# EAGLE design INA219x4 FeatherWing (EAGLE 9.4.2)
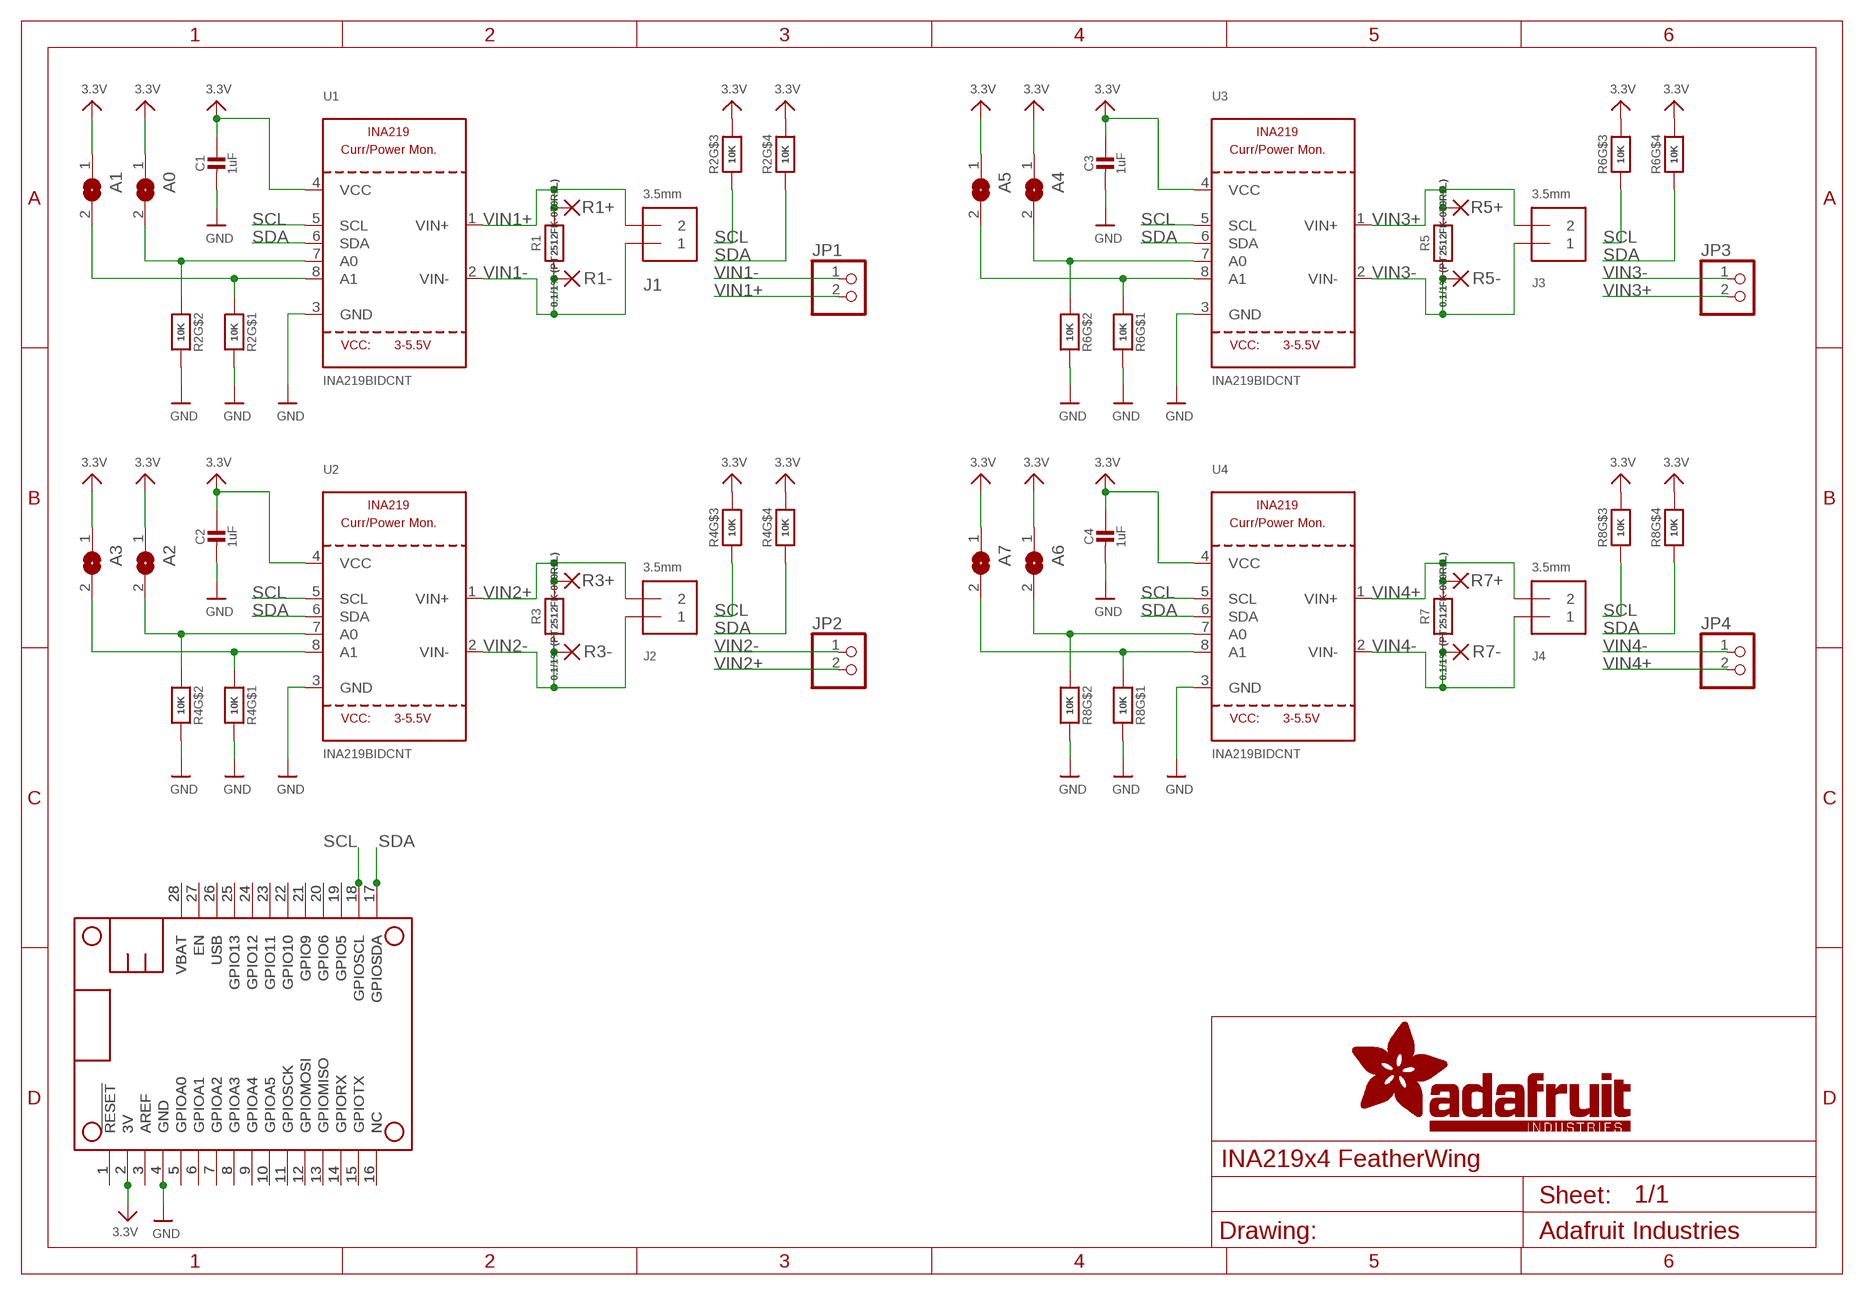
[diagram p0: schematic, sheet 1]

## Parts
A0  SOLDERJUMPERREFLOW_NOPASTE  [SOLDERJUMPER_REFLOW_NOPASTE]
A1  SOLDERJUMPERREFLOW_NOPASTE  [SOLDERJUMPER_REFLOW_NOPASTE]
A2  SOLDERJUMPERREFLOW_NOPASTE  [SOLDERJUMPER_REFLOW_NOPASTE]
A3  SOLDERJUMPERREFLOW_NOPASTE  [SOLDERJUMPER_REFLOW_NOPASTE]
A4  SOLDERJUMPERREFLOW_NOPASTE  [SOLDERJUMPER_REFLOW_NOPASTE]
A5  SOLDERJUMPERREFLOW_NOPASTE  [SOLDERJUMPER_REFLOW_NOPASTE]
A6  SOLDERJUMPERREFLOW_NOPASTE  [SOLDERJUMPER_REFLOW_NOPASTE]
A7  SOLDERJUMPERREFLOW_NOPASTE  [SOLDERJUMPER_REFLOW_NOPASTE]
C1  1uF  CAP_CERAMIC0805-NOOUTLINE  [0805-NO@1]
C2  1uF  CAP_CERAMIC0805-NOOUTLINE  [0805-NO@1]
C3  1uF  CAP_CERAMIC0805-NOOUTLINE  [0805-NO@1]
C4  1uF  CAP_CERAMIC0805-NOOUTLINE  [0805-NO@1]
J1  3.5mm  TERMBLOCK_1X2  [TERMBLOCK_1X2-3.5MM]
J2  3.5mm  TERMBLOCK_1X2  [TERMBLOCK_1X2-3.5MM]
J3  3.5mm  TERMBLOCK_1X2  [TERMBLOCK_1X2-3.5MM]
J4  3.5mm  TERMBLOCK_1X2  [TERMBLOCK_1X2-3.5MM]
JP1  HEADER-1X2ROUND  [1X02_ROUND]
JP2  HEADER-1X2ROUND  [1X02_ROUND]
JP3  HEADER-1X2ROUND  [1X02_ROUND]
JP4  HEADER-1X2ROUND  [1X02_ROUND]
MS1  FEATHERWING_NODIM  [FEATHERWING_DIM]
MS2  FEATHERWING_NODIM  [FEATHERWING_DIM]
R1  0.1/1% (PT2512FK-070R1L)  RESISTOR2512  [2512]
R1+  1,6/0,9  [1,6/0,9]
R1-  1,6/0,9  [1,6/0,9]
R2  10K  RESISTOR_4PACK  [RESPACK_4X0603]
R3  0.1/1% (PT2512FK-070R1L)  RESISTOR2512  [2512]
R3+  1,6/0,9  [1,6/0,9]
R3-  1,6/0,9  [1,6/0,9]
R4  10K  RESISTOR_4PACK  [RESPACK_4X0603]
R5  0.1/1% (PT2512FK-070R1L)  RESISTOR2512  [2512]
R5+  1,6/0,9  [1,6/0,9]
R5-  1,6/0,9  [1,6/0,9]
R6  10K  RESISTOR_4PACK  [RESPACK_4X0603]
R7  0.1/1% (PT2512FK-070R1L)  RESISTOR2512  [2512]
R7+  1,6/0,9  [1,6/0,9]
R7-  1,6/0,9  [1,6/0,9]
R8  10K  RESISTOR_4PACK  [RESPACK_4X0603]
U1  INA219BIDCNT  INA219  [SOT23-8]
U2  INA219BIDCNT  INA219  [SOT23-8]
U3  INA219BIDCNT  INA219  [SOT23-8]
U4  INA219BIDCNT  INA219  [SOT23-8]

## Nets
3.3V: A0.1 A1.1 A2.1 A3.1 A4.1 A5.1 A6.1 A7.1 C1.1 C2.1 C3.1 C4.1 MS1.2(3V) MS2.2(3V) R2.5 R2.6 R4.5 R4.6 R6.5 R6.6 R8.5 R8.6 U1.4(VCC) U2.4(VCC) U3.4(VCC) U4.4(VCC)
GND: C1.2 C2.2 C3.2 C4.2 MS1.4(GND) MS2.4(GND) R2.7 R2.8 R4.7 R4.8 R6.7 R6.8 R8.7 R8.8 U1.3(GND) U2.3(GND) U3.3(GND) U4.3(GND)
N$1: MS1.27(EN) MS2.27(EN)
N$2: MS1.16(NC) MS2.16(NC)
N$3: MS1.25(GPIO13) MS2.25(GPIO13)
N$4: MS1.15(GPIOTX) MS2.15(GPIOTX)
N$5: MS1.24(GPIO12) MS2.24(GPIO12)
N$6: MS1.14(GPIORX) MS2.14(GPIORX)
N$7: MS1.13(GPIOMISO) MS2.13(GPIOMISO)
N$8: MS1.12(GPIOMOSI) MS2.12(GPIOMOSI)
N$9: MS1.11(GPIOSCK) MS2.11(GPIOSCK)
N$10: MS1.10(GPIOA5) MS2.10(GPIOA5)
N$11: MS1.9(GPIOA4) MS2.9(GPIOA4)
N$12: MS1.8(GPIOA3) MS2.8(GPIOA3)
N$13: MS1.7(GPIOA2) MS2.7(GPIOA2)
N$14: MS1.6(GPIOA1) MS2.6(GPIOA1)
N$15: MS1.5(GPIOA0) MS2.5(GPIOA0)
N$16: A1.2 R2.1 U1.8(A1)
N$17: MS1.3(AREF) MS2.3(AREF)
N$18: MS1.1(!RESET) MS2.1(!RESET)
N$19: MS1.23(GPIO11) MS2.23(GPIO11)
N$20: MS1.22(GPIO10) MS2.22(GPIO10)
N$21: MS1.21(GPIO9) MS2.21(GPIO9)
N$22: MS1.20(GPIO6) MS2.20(GPIO6)
N$23: MS1.19(GPIO5) MS2.19(GPIO5)
N$24: A5.2 R6.1 U3.8(A1)
N$25: A4.2 R6.2 U3.7(A0)
N$26: A0.2 R2.2 U1.7(A0)
N$27: A3.2 R4.1 U2.8(A1)
N$28: A2.2 R4.2 U2.7(A0)
N$29: A7.2 R8.1 U4.8(A1)
N$30: A6.2 R8.2 U4.7(A0)
SCL: MS1.18(GPIOSCL) MS2.18(GPIOSCL) R2.3 R4.3 R6.3 R8.3 U1.5(SCL) U2.5(SCL) U3.5(SCL) U4.5(SCL)
SDA: MS1.17(GPIOSDA) MS2.17(GPIOSDA) R2.4 R4.4 R6.4 R8.4 U1.6(SDA) U2.6(SDA) U3.6(SDA) U4.6(SDA)
USB: MS1.26(USB) MS2.26(USB)
VBAT: MS1.28(VBAT) MS2.28(VBAT)
VIN1+: J1.2 JP1.2 R1+.1(P) R1.2 U1.1(VIN+)
VIN1-: J1.1 JP1.1 R1-.1(P) R1.1 U1.2(VIN-)
VIN2+: J2.2 JP2.2 R3+.1(P) R3.2 U2.1(VIN+)
VIN2-: J2.1 JP2.1 R3-.1(P) R3.1 U2.2(VIN-)
VIN3+: J3.2 JP3.2 R5+.1(P) R5.2 U3.1(VIN+)
VIN3-: J3.1 JP3.1 R5-.1(P) R5.1 U3.2(VIN-)
VIN4+: J4.2 JP4.2 R7+.1(P) R7.2 U4.1(VIN+)
VIN4-: J4.1 JP4.1 R7-.1(P) R7.1 U4.2(VIN-)

## Library data of the parts
A0 A1-A7 = microbuilder:SOLDERJUMPER: SMD Solder JUMPER Solder the two pads together to create a connection, or remove the solder to break it. REFLOW - Use this footprint for solder paste and reflow ovens. WAVE - Use this footprint for hand-soldering (larger pads). CLOSED - Has a trace between the two pads to ensure it is closed by default. The trace needs to be cut to disable the jumper, and can be closed again by creating a solder bridge between the two pads.
C1-C4 = microbuilder:CAP_CERAMIC: Ceramic Capacitors For new designs, use the packages preceded by an '_' character since they are more reliable: The following footprints should be used on most boards: _0402 - Standard footprint for regular board layouts _0603 - Standard footprint for regular board layouts _0805 - Standard footprint for regular board layouts _1206 - Standard footprint for regular board layouts For extremely tight-pitch boards where space is at a premium, the following 'micro-pitch' footprints can be used (smaller pads, no silkscreen outline, etc.): _0402MP - Micro-pitch footprint for very dense/compact boards _0603MP - Micro-pitch footprint for very dense/compact boards _0805MP - Micro-pitch footprint for very dense/compact boards _1206MP - Micro-pitch footprint for very dense/compact boards
J1-J4 = microbuilder:TERMBLOCK_1X2: 3.5mm Terminal block http://www.ladyada.net/library/pcb/eaglelibrary.html
JP1-JP4 = microbuilder:HEADER-1X2: PIN HEADER
MS1 MS2 = microbuilder:FEATHERWING
R1 R3 R5 R7 = microbuilder:RESISTOR: Resistors For new designs, use the packages preceded by an '_' character since they are more reliable: The following footprints should be used on most boards: _0402 - Standard footprint for regular board layouts _0603 - Standard footprint for regular board layouts _0805 - Standard footprint for regular board layouts _1206 - Standard footprint for regular board layouts For extremely tight-pitch boards where space is at a premium, the following 'micro-pitch' footprints can be used (smaller pads, no silkscreen outline, etc.): _0402MP - Micro-pitch footprint for very dense/compact boards _0603MP - Micro-pitch footprint for very dense/compact boards _0805MP - Micro-pitch footprint for very dense/compact boards _1206MP - Micro-pitch footprint for very dense/compact boards
R1+ R1- R3+ R3- R5+ R5- R7+ R7- = wirepad:1,6/0,9: THROUGH-HOLE PAD
R2 R4 R6 R8 = microbuilder:RESISTOR_4PACK: Resistor Packs (4 resistors) 4 x 0603 10K 1/16W - Digikey: YC164J-10KCT-ND
U1-U4 = microbuilder:INA219: INA219 - I2C Current/Power Monitor Voltage Range: 0-26V Accuracy: 0.5% Temperature: -40°C - 125°C

## Board
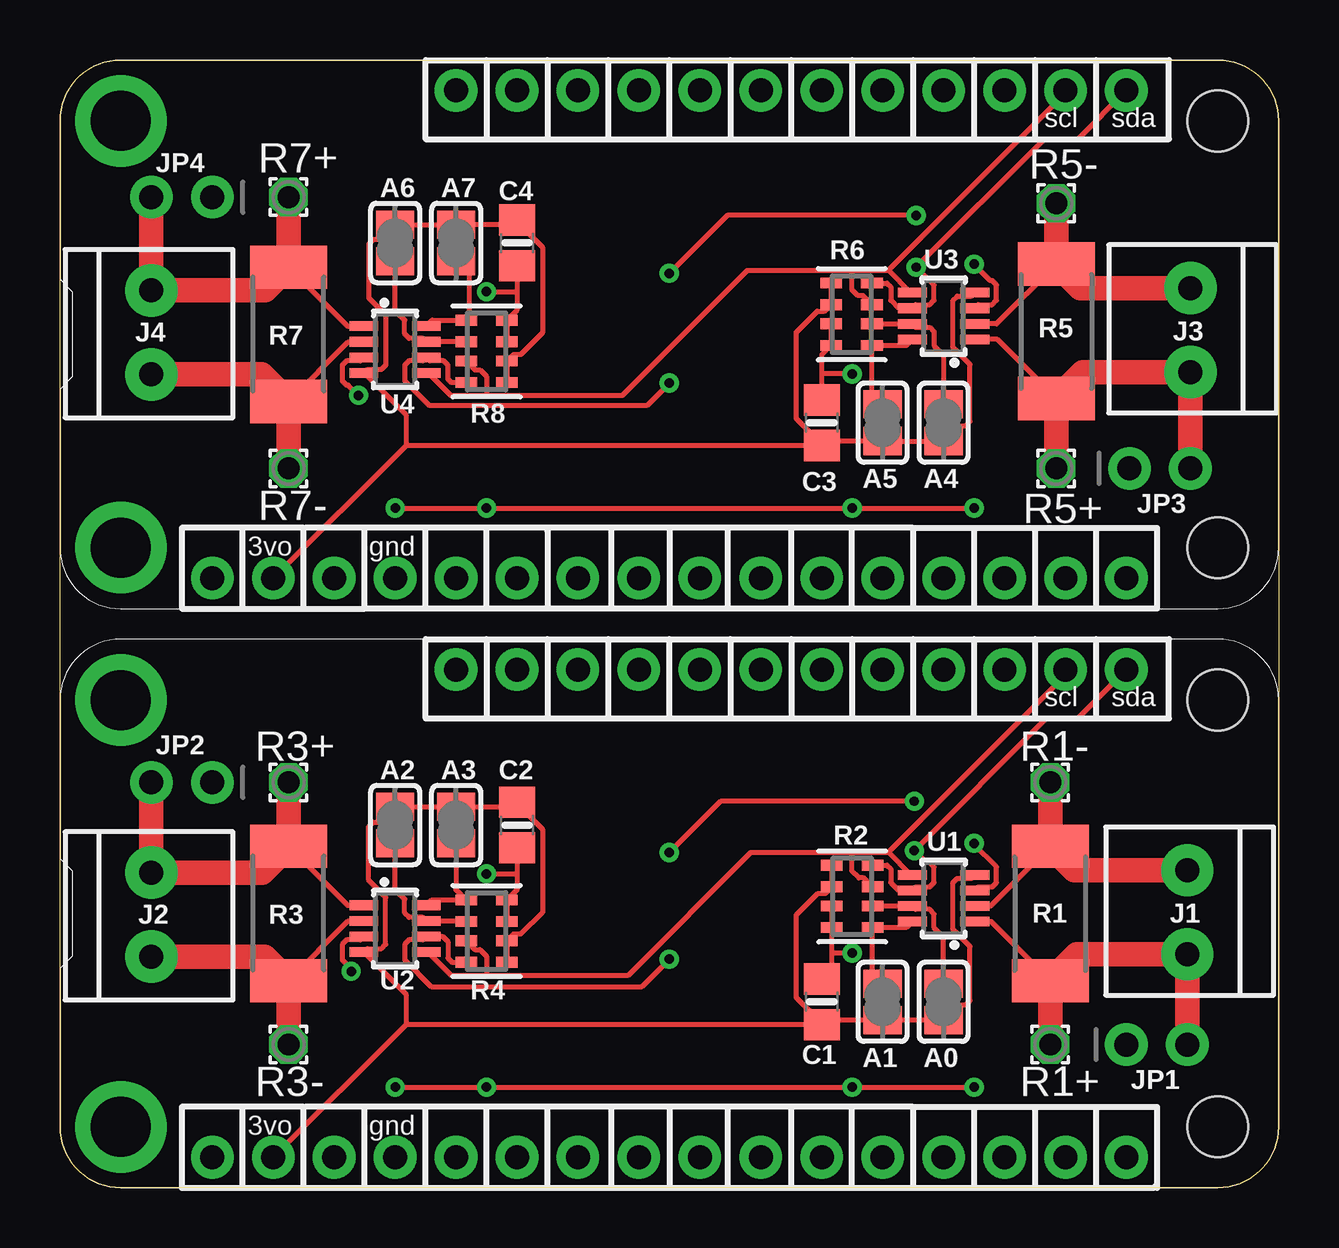
[diagram p1: board, top side]
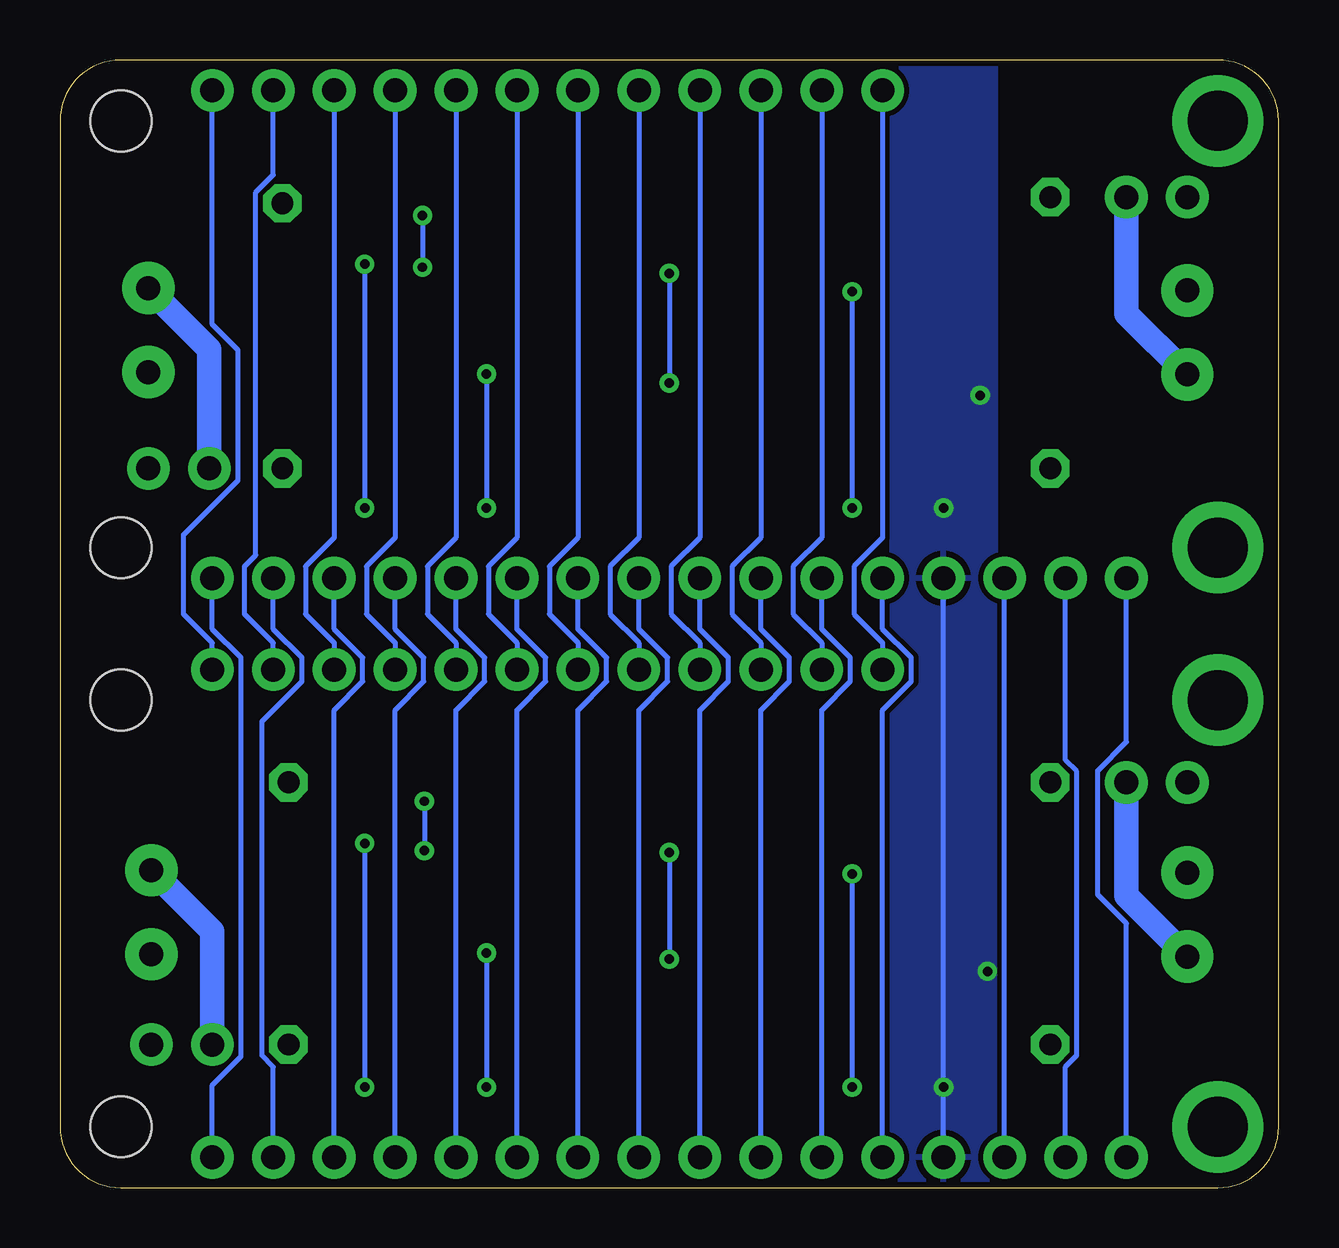
[diagram p2: board, bottom side, seen from below]

Size 50.8 x 46.99 mm. Coordinates in mm from the lower left corner, seen from the top.
Outline: 2.54,46.99 48.26,46.99 arc-90 50.8,44.45 50.8,2.54 arc-90 48.26,0 2.54,0 arc-90 0,2.54 0,44.45 arc-90 2.54,46.99
Copper layers (1*16): Top 0.035mm / dielectric 1.5mm / Bottom 0.035mm
Design rules "adafruit": minimum track width 8mil, minimum drill 15.5mil, track to track 8mil, track to pad 8mil, pad to pad 8mil, via to via 8mil, smd to smd 8mil, copper to edge 10mil, drill to drill 8mil, minimum pad ring 10mil, minimum via ring 8mil, stop-mask expansion 2mil, vias tented up to drill 20mil, thermal gap 10mil

### Footprints (pad centres in the part's own frame; a part is rotated, then mirrored left to right if it is on the bottom)
SOLDERJUMPER_REFLOW_NOPASTE = smd 1.168 x 1.6: 1 -0.762,0; 2 0.762,0
0805-NO@1 = smd 1.3 x 1.5: 1 -0.95,0; 2 0.95,0
TERMBLOCK_1X2-3.5MM = drill 1 pad 2.184: 1 1.8,0; 2 -1.7,0
1X02_ROUND = drill 1 pad 1.778: 1 -1.27,0; 2 1.27,0
FEATHERWING_DIM = drill 1 pad 1.778: 1 6.35,1.27; 2 8.89,1.27; 3 11.43,1.27; 4 13.97,1.27; 5 16.51,1.27; 6 19.05,1.27; 7 21.59,1.27; 8 24.13,1.27; 9 26.67,1.27; 10 29.21,1.27; 11 31.75,1.27; 12 34.29,1.27; 13 36.83,1.27; 14 39.37,1.27; 15 41.91,1.27; 16 44.45,1.27; 17 44.45,21.59; 18 41.91,21.59; 19 39.37,21.59; 20 36.83,21.59; 21 34.29,21.59; 22 31.75,21.59; 23 29.21,21.59; 24 26.67,21.59; 25 24.13,21.59; 26 21.59,21.59; 27 19.05,21.59; 28 16.51,21.59 | drill 2.5 pad 3.81: P$1 2.54,20.32; P$2 2.54,2.54 | hole 2.54: 48.26,20.32; 48.26,2.54
2512 = smd 1.8 x 3.2: 1 -2.8,0; 2 2.8,0
1,6/0,9 = drill 0.914 pad 1.6 octagon: 1 0,0
RESPACK_4X0603 = smd 0.45 x 0.9: 1 -1.3,-0.85; 2 -0.4,-0.85; 3 0.4,-0.85; 4 1.3,-0.85; 5 1.3,0.85; 6 0.4,0.85; 7 -0.4,0.85; 8 -1.3,0.85
SOT23-8 = smd 0.4 x 1.2: 1 -0.975,-1.3; 2 -0.325,-1.3; 3 0.325,-1.3; 4 0.975,-1.3; 5 0.975,1.3; 6 0.325,1.3; 7 -0.325,1.3; 8 -0.975,1.3

### Placement (x,y rotation side)
A0  36.83,7.75 90 top
A1  34.29,7.75 90 top
A2  13.97,15.11 270 top
A3  16.51,15.11 270 top
A4  36.83,31.88 90 top
A5  34.29,31.88 90 top
A6  13.97,39.37 270 top
A7  16.51,39.37 270 top
C1  31.75,7.75 90 top
C2  19.05,15.11 270 top
C3  31.75,31.88 90 top
C4  19.05,39.37 270 top
J1  46.99,11.43 90 top
J2  3.81,11.43 270 top
J3  47.12,35.69 90 top
J4  3.81,35.69 270 top
JP1  45.72,5.97 0 top
JP2  5.08,16.89 180 top
JP3  45.85,29.97 0 top
JP4  5.08,41.27 180 top
MS1  0,0 0 top
MS2  0,24.13 0 top
R1  41.27,11.43 270 top
R1+  41.27,5.97 0 top
R1-  41.27,16.89 0 top
R2  33.02,12.14 90 top
R3  9.53,11.43 90 top
R3+  9.53,16.89 0 top
R3-  9.53,5.97 0 top
R4  17.78,10.69 270 top
R5  41.53,35.69 270 top
R5+  41.53,29.97 0 top
R5-  41.53,41.02 0 top
R6  32.99,36.4 90 top
R7  9.53,35.56 90 top
R7+  9.53,41.27 0 top
R7-  9.53,29.97 0 top
R8  17.78,34.85 270 top
U1  36.83,12.06 90 top
U2  13.97,10.79 270 top
U3  36.83,36.32 90 top
U4  13.97,34.92 270 top

### Tracks (layer width: path | path; a pad name or v marks a point on that pad's centre or on a via)
3.3V
  Top 0.203: R4.5 R4.6 18.9,10.56 19.21,10.56 20.11,11.46 20.11,14.94 19.05,15.99 C2.1 18.86,15.88 A3.1 A2.1 13.34,15.24 13.04,15.24 12.87,15.06 12.87,12.81 13.57,12.1 13.57,10.14 13.4,9.96 12.81,9.96 U2.4 14.42,8.07 14.42,6.8 | C1.1 31.94,6.99 A1.1 A0.1 37.47,7.62 37.76,7.62 37.94,7.8 37.94,10.05 37.23,10.76 37.23,12.72 37.4,12.89 37.98,12.89 U1.4 | R2.5 R2.6 31.9,12.27 31.59,12.27 30.7,11.37 30.7,7.92 31.75,6.87 C1.1 | R6.5 R6.6 31.87,36.53 31.57,36.53 30.7,35.66 30.7,32.05 31.75,31 C3.1 | R8.5 R8.6 18.9,34.72 19.21,34.72 20.11,35.62 20.11,39.2 19.05,40.25 C4.1 18.86,40.13 A7.1 A6.1 13.34,39.5 13.04,39.5 12.87,39.32 12.87,37.08 13.57,36.37 13.57,34.27 13.4,34.09 12.81,34.09 U4.4 14.42,32.2 14.42,30.93 | C3.1 31.94,31.11 A5.1 A4.1 37.47,31.75 37.76,31.75 37.94,31.93 37.94,34.31 37.23,35.02 37.23,36.97 37.4,37.15 37.98,37.15 U3.4 | MS1.2 14.42,6.8 | C1.1 14.42,6.8 | C3.1 14.42,30.93 | 14.42,30.93 MS2.2
  Bottom 0.203: MS1.2 8.89,5.04 8.42,5.51 8.42,17.35 8.89,17.82 MS2.2
GND  (via drill 0.39)
  Top 0.203: R4.7 R4.8 19.05,12.41 19.05,13.08 | R2.7 R2.8 32.17,9.78 | R6.7 R6.8 31.75,34.7 31.75,33.91 | R8.7 R8.8 19.05,36.57 19.05,37.34 | C3.2 31.75,33.91 | C4.2 19.05,37.34 | C2.2 19.05,13.08 | C1.2 32.17,9.12 32.17,9.78 | U2.3 12.53,10.32 11.94,10.32 11.77,10.15 11.77,9.49 12.14,9.12 v12.14,9.02 | U1.3 38.27,12.54 38.86,12.54 39.03,12.71 39.03,13.37 38.1,14.3 v38.1,14.35 | v33.02,9.78 32.17,9.78 | v13.97,4.19 v17.78,4.19 v33.02,4.19 v38.1,4.19 | v17.78,13.08 19.05,13.08 | U4.3 12.53,34.45 11.94,34.45 11.77,34.28 11.77,33.62 11.94,33.45 12.02,33.45 v12.45,33.02 | v17.78,37.34 19.05,37.34 | v13.97,28.32 v17.78,28.32 v33.02,28.32 v38.1,28.32 | v33.02,33.91 31.75,33.91 | U3.3 38.27,36.79 38.86,36.79 39.03,36.97 39.03,37.62 38.86,37.8 38.78,37.8 v38.1,38.48
  Bottom 0.203: MS1.4 v13.97,4.19 MS2.4 | v33.02,9.78 v33.02,4.19 | v17.78,13.08 v17.78,4.19 | v17.78,37.34 v17.78,28.32 | v33.02,33.91 v33.02,28.32 | v38.1,38.48 v38.1,28.32 | v38.1,14.35 v38.1,4.19
  pour Bottom: 16.13,46.74 11.81,46.74 11.81,0.25 16.13,0.25
N$1
  Bottom 0.203: MS1.27 19.05,22.7 20.24,23.9 20.24,25.89 19.05,27.09 MS2.27
N$2
  Bottom 0.203: MS1.16 44.45,4.28 43.26,5.47 43.26,22.08 44.45,23.28 MS2.16
N$3
  Bottom 0.203: MS1.25 24.13,22.7 25.32,23.9 25.32,25.89 24.13,27.09 MS2.25
N$4
  Bottom 0.203: MS1.15 41.91,5.04 42.38,5.51 42.38,19.43 40.72,21.1 40.72,22.08 41.91,23.28 MS2.15
N$5
  Bottom 0.203: MS1.24 26.67,22.7 27.86,23.9 27.86,25.89 26.67,27.09 MS2.24
N$6
  Bottom 0.203: MS1.14 39.37,19.9 38.18,21.1 38.18,22.08 39.37,23.28 MS2.14
N$7
  Bottom 0.203: MS1.13 36.83,19.9 35.64,21.1 35.64,22.08 36.83,23.28 MS2.13
N$8
  Bottom 0.203: MS1.12 34.29,19.9 33.1,21.1 33.1,22.08 34.29,23.28 MS2.12
N$9
  Bottom 0.203: MS1.11 31.75,19.9 30.56,21.1 30.56,22.08 31.75,23.28 MS2.11
N$10
  Bottom 0.203: MS1.10 29.21,19.9 28.02,21.1 28.02,22.08 29.21,23.28 MS2.10
N$11
  Bottom 0.203: MS1.9 26.67,19.9 25.48,21.1 25.48,22.08 26.67,23.28 MS2.9
N$12
  Bottom 0.203: MS1.8 24.13,19.9 22.94,21.1 22.94,22.08 24.13,23.28 MS2.8
N$13
  Bottom 0.203: MS1.7 21.59,19.9 20.4,21.1 20.4,22.08 21.59,23.28 MS2.7
N$14
  Bottom 0.203: MS1.6 19.05,19.9 17.86,21.1 17.86,22.08 19.05,23.28 MS2.6
N$15
  Bottom 0.203: MS1.5 16.51,19.9 15.32,21.1 15.32,22.08 16.51,23.28 MS2.5
N$16
  Top 0.203: U1.8 35.28,10.84 R2.1 33.87,8.93 A1.2
N$17
  Bottom 0.203: MS1.3 MS2.3
N$18
  Bottom 0.203: MS1.1 6.35,11.02 7.54,12.21 7.54,17.39 6.35,18.58 MS2.1
N$19
  Bottom 0.203: MS1.23 29.21,22.7 30.4,23.9 30.4,25.89 29.21,27.09 MS2.23
N$20
  Bottom 0.203: MS1.22 31.75,22.7 32.94,23.9 32.94,25.89 31.75,27.09 MS2.22
N$21
  Bottom 0.203: MS1.21 34.29,22.7 35.48,23.9 35.48,25.89 34.29,27.09 MS2.21
N$22
  Bottom 0.203: MS1.20 36.83,22.7 38.02,23.9 38.02,25.89 36.83,27.09 MS2.20
N$23
  Bottom 0.203: MS1.19 39.37,22.7 40.56,23.9 40.56,25.89 39.37,27.09 MS2.19
N$24
  Top 0.203: U3.8 35.28,35.1 R6.1 33.84,33.08 A5.2
N$25
  Top 0.203: R6.2 U3.7 35.67,35.85 36.26,35.85 36.44,35.67 36.44,35.09 36.83,34.7 A4.2
N$26
  Top 0.203: R2.2 U1.7 35.67,11.6 36.26,11.6 36.44,11.42 36.44,10.84 36.83,10.44 A0.2
N$27
  Top 0.203: U2.8 15.49,11.99 R4.1 16.51,12.41 A3.2
N$28
  Top 0.203: R4.2 16.9,11.12 U2.7 15.12,11.27 14.54,11.27 14.37,11.44 14.37,12.03 13.97,12.42 A2.2
N$29
  Top 0.203: U4.8 15.52,36.15 R8.1 17.06,36.28 17.06,38.06 A7.2
N$30
  Top 0.203: R8.2 U4.7 15.12,35.4 14.54,35.4 14.37,35.57 14.37,36.16 13.97,36.55 A6.2
SCL
  Top 0.203: U4.5 15.35,33.95 16.28,33.02 17.78,33.02 | U3.5 35.45,37.3 34.52,38.23 | 17.78,33.02 23.44,33.02 28.65,38.23 33.02,38.23 | 33.02,38.23 34.52,38.23 | R8.3 17.3,34.08 17.51,34.08 17.78,33.8 17.78,33.02 | R6.3 33.47,37.17 33.27,37.17 33.02,37.42 33.02,38.23 | U2.5 15.35,9.82 16.3,8.86 17.78,8.86 | U1.5 35.45,13.04 34.52,13.97 | 17.78,8.86 23.69,8.86 28.8,13.97 33.02,13.97 | 33.02,13.97 34.52,13.97 | R4.3 17.3,9.92 17.51,9.92 17.78,9.65 17.78,8.86 | R2.3 33.5,12.91 33.29,12.91 33.02,13.19 33.02,13.97 | 34.52,13.97 41.91,21.36 MS1.18 | 34.52,38.23 41.91,45.61 MS2.18
  Bottom 0.203: MS1.18 41.91,22.7 43.1,23.9 43.1,25.89 42.63,26.36 42.63,41.48 41.91,42.2 MS2.18
SDA  (via drill 0.39)
  Top 0.203: R4.4 16.35,9.39 16.18,9.56 16.18,9.57 16.18,10.24 15.95,10.47 U2.6 15.12,10.32 14.54,10.32 14.37,10.15 14.37,9.49 15.48,8.38 24.26,8.38 v25.4,9.53 | R2.4 34.48,13.44 34.62,13.29 34.62,12.71 34.95,12.39 U1.6 35.67,12.54 36.26,12.54 36.44,12.71 36.44,13.37 36.26,13.54 36.11,13.54 v35.61,14.05 41.12,19.56 42.42,19.56 MS1.17 | R6.4 34.48,37.7 34.62,37.55 34.62,36.97 34.95,36.65 U3.6 35.67,36.79 36.26,36.79 36.44,36.97 36.44,37.62 36.26,37.8 36.24,37.8 v35.69,38.35 41.02,43.69 42.42,43.69 MS2.17 | R8.4 16.32,33.55 16.18,33.7 16.18,34.28 16,34.45 15.41,34.45 U4.6 15.12,34.45 14.54,34.45 14.37,34.28 14.37,33.62 15.38,32.61 24.48,32.61 v25.4,33.53 | v35.61,16.1 27.53,16.1 v25.4,13.97 | v35.69,40.51 27.81,40.51 v25.4,38.1
  Bottom 0.203: v35.61,16.1 v35.61,14.05 | v25.4,13.97 v25.4,9.53 | v25.4,38.1 v25.4,33.53 | v35.69,40.51 v35.69,38.35 | MS1.17 44.45,22.7 45.64,23.9 45.64,27.22 43.38,29.48 43.38,34.9 44.45,35.97 MS2.17
USB
  Bottom 0.203: MS1.26 21.59,22.7 22.78,23.9 22.78,25.89 21.59,27.09 MS2.26
VBAT
  Bottom 0.203: MS1.28 16.51,22.7 17.7,23.9 17.7,25.89 16.51,27.09 MS2.28
VIN1+
  Top 0.203: R1.2 38.81,11.09 U1.1
  Top 1.016: JP1.2 J1.2 42.38,9.73 R1.2 R1+.1
VIN1-
  Top 0.203: R1.1 38.78,11.74 U1.2
  Top 1.016: J1.1 42.27,13.23 R1.1 R1-.1
  Bottom 1.016: J1.1 44.45,10.69 JP1.1
VIN2+
  Top 0.203: R3.2 11.98,11.77 U2.1
  Top 1.016: JP2.2 J2.2 8.43,13.13 R3.2 R3+.1
VIN2-
  Top 0.203: R3.1 12.02,11.12 U2.2
  Top 1.016: J2.1 8.53,9.63 R3.1 R3-.1
  Bottom 1.016: J2.1 6.35,12.17 JP2.1
VIN3+
  Top 0.203: R5.2 39.07,35.35 U3.1
  Top 1.016: R5+.1 R5.2 42.63,33.99 J3.2 JP3.2
VIN3-
  Top 0.203: R5.1 39.04,36 U3.2
  Top 1.016: J3.1 42.53,37.49 R5.1 R5-.1
  Bottom 1.016: J3.1 44.58,34.95 JP3.1
VIN4+
  Top 0.203: R7.2 11.98,35.9 U4.1
  Top 1.016: R7+.1 R7.2 8.55,37.39 J4.2 JP4.2
VIN4-
  Top 0.203: R7.1 12.02,35.25 U4.2
  Top 1.016: J4.1 8.4,33.89 R7.1 R7-.1
  Bottom 1.016: J4.1 6.35,36.43 JP4.1

### Text on the board
tPlace: scl | sda | 3vo | gnd | scl | sda | 3vo | gnd